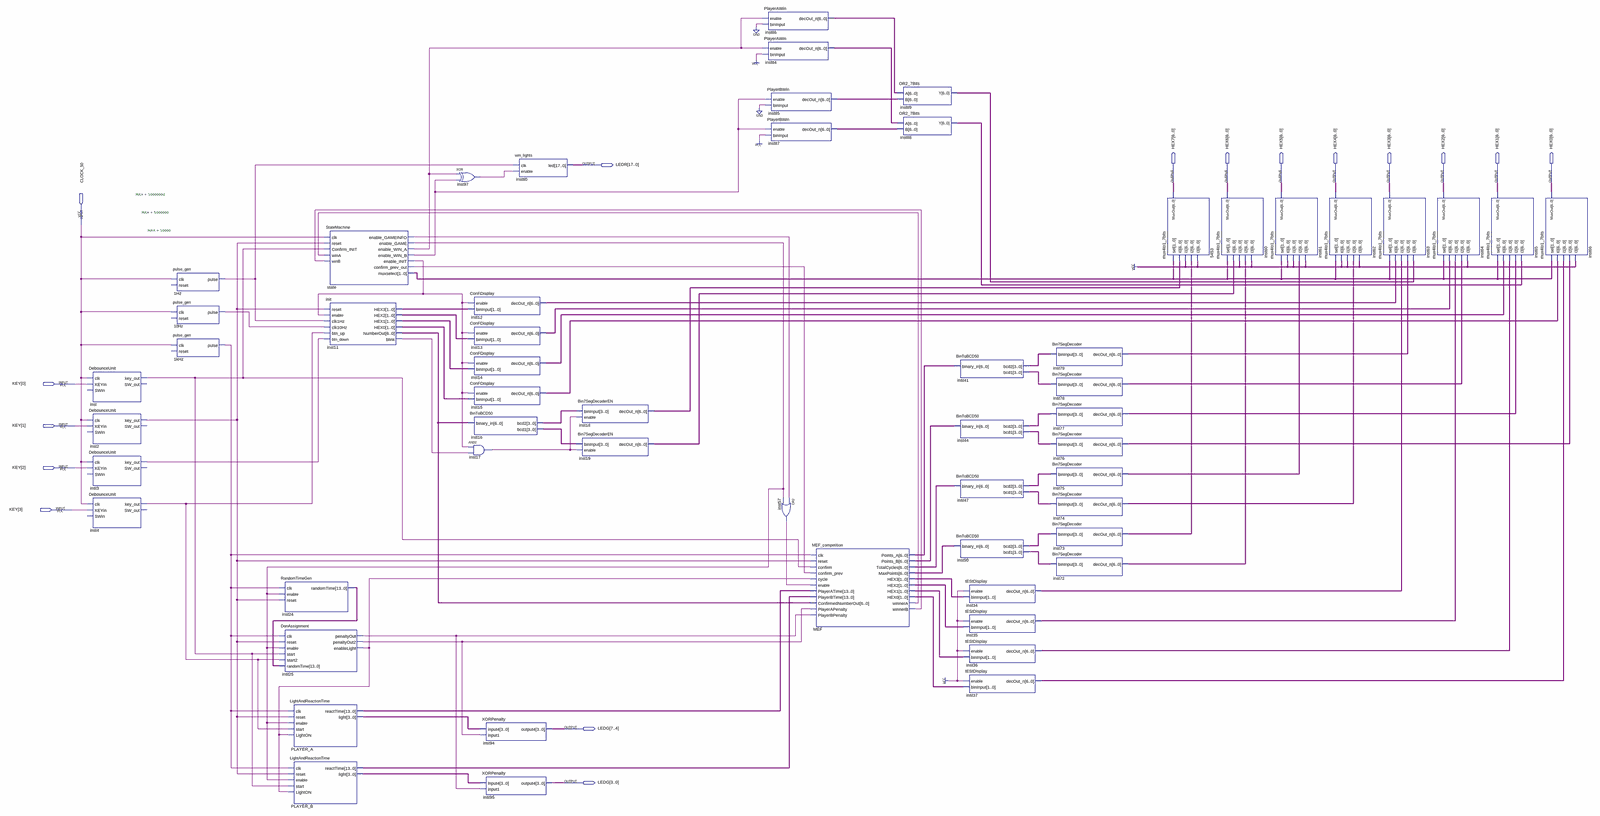
[diagram p0: schematic sheet, whole]
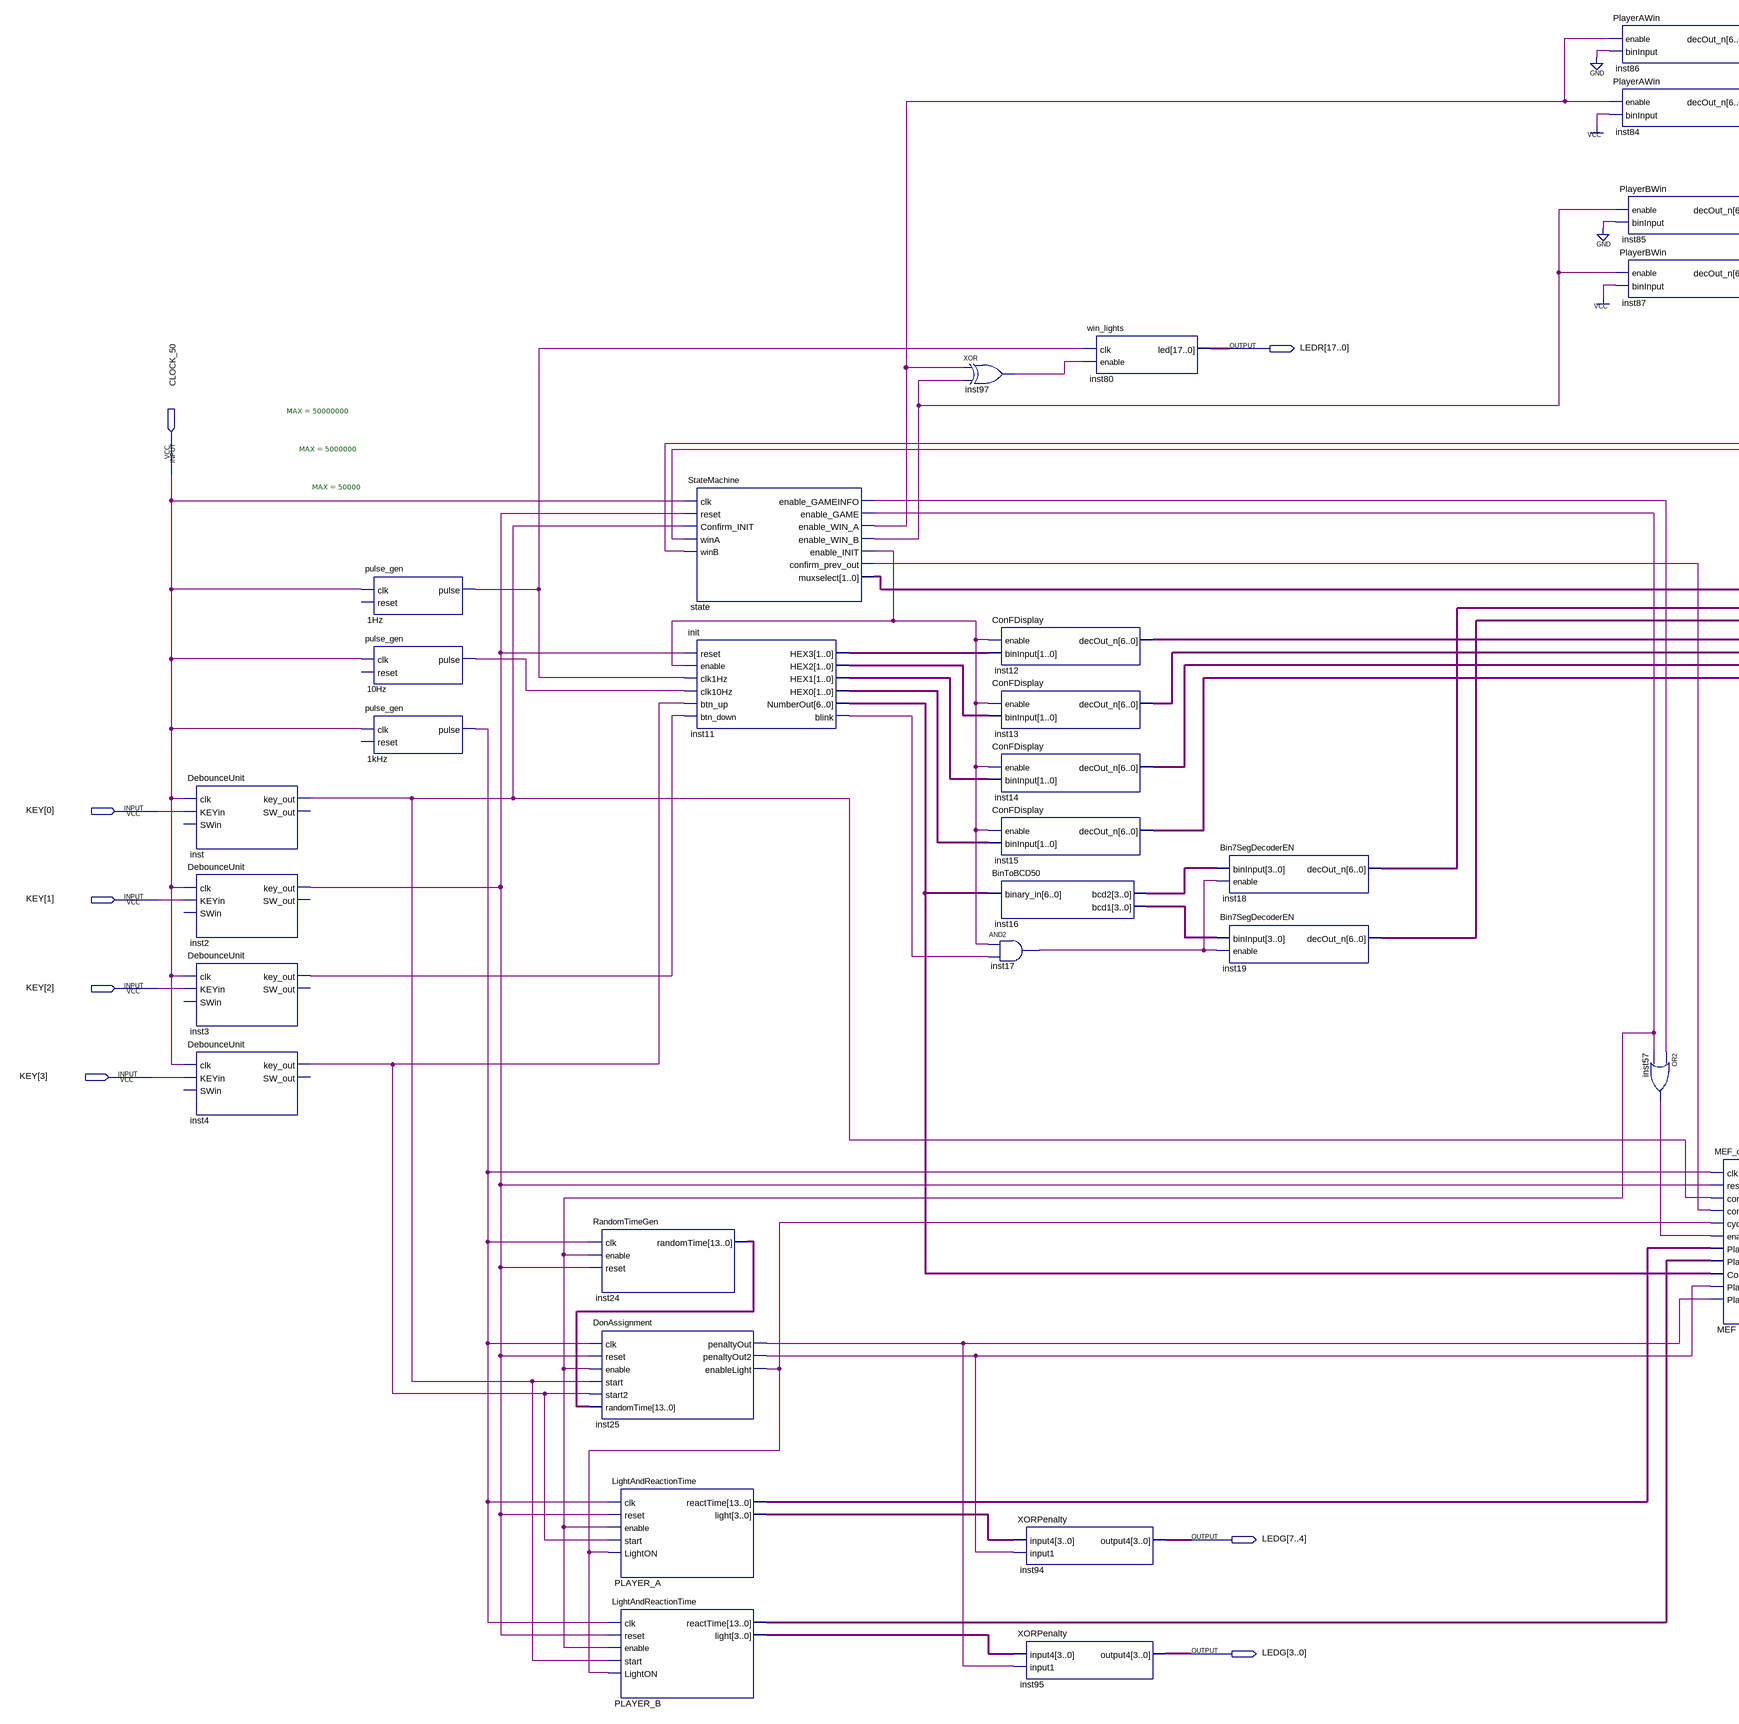
[diagram p1: schematic sheet, left part]
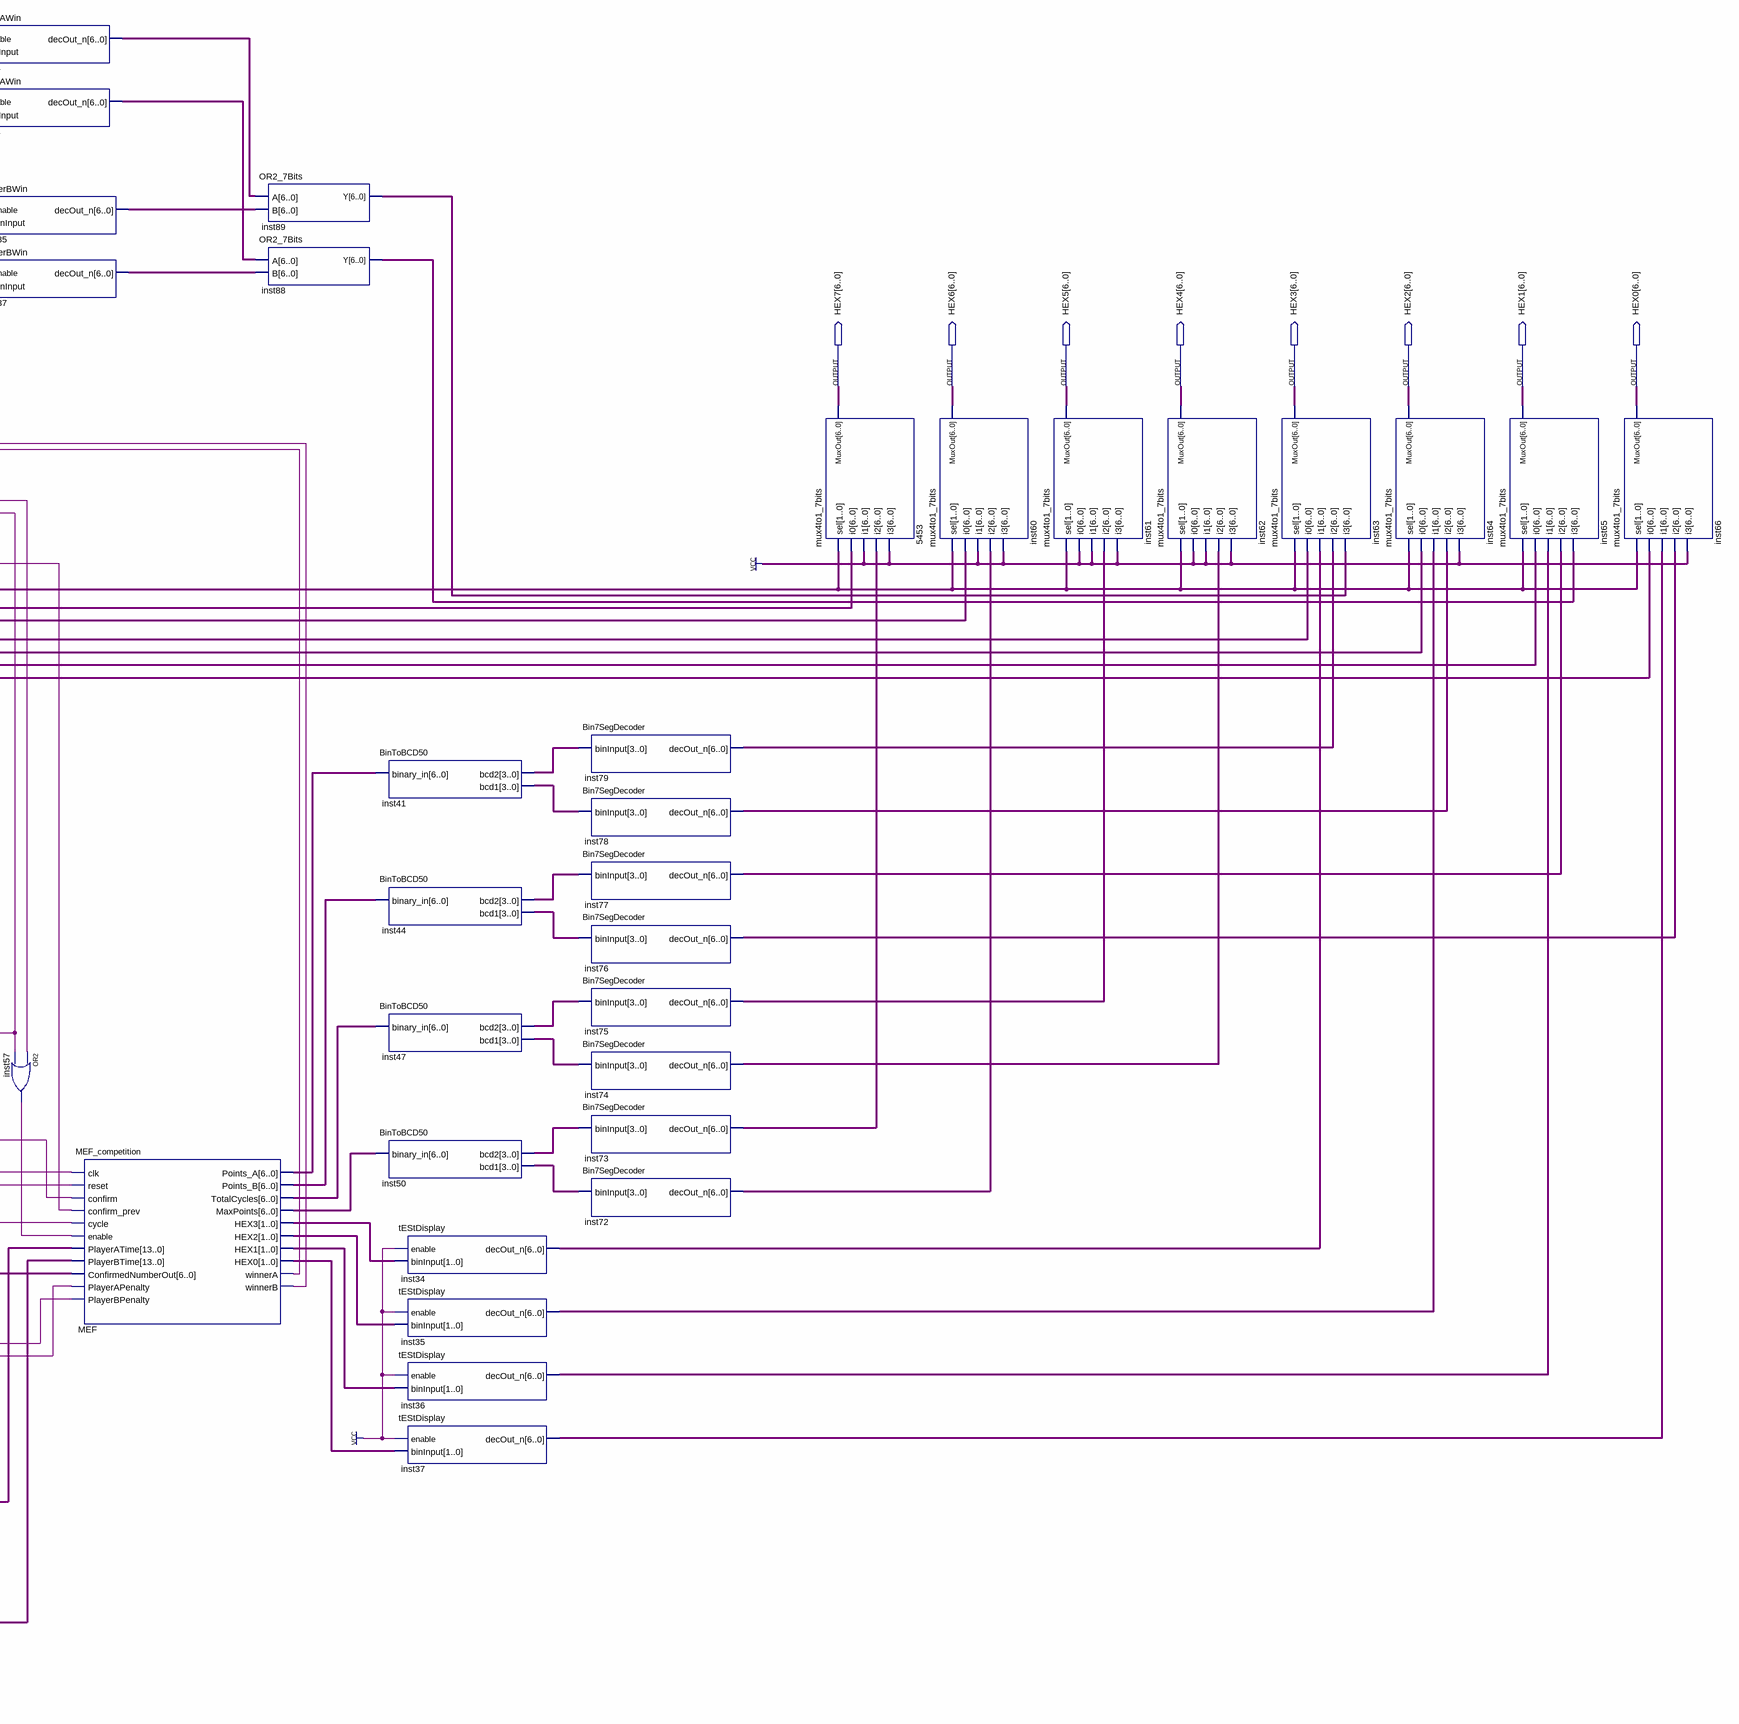
[diagram p2: schematic sheet, right part]
// Quartus schematic ReactionGame.bdf as structural Verilog: 57 symbols, 16 pins
module ReactionGame (
  input  CLOCK_50,
  input  [3:0] KEY,
  output [17:0] LEDR,
  output [6:0] HEX7,
  output [6:0] HEX6,
  output [6:0] HEX5,
  output [6:0] HEX4,
  output [6:0] HEX3,
  output [6:0] HEX2,
  output [6:0] HEX1,
  output [6:0] HEX0,
  output [7:0] LEDG
);

  wire inst2_key_out, inst3_key_out, inst4_key_out, inst11_blink, inst17_out, inst25_enablelight,
       inst25_penaltyout, inst25_penaltyout2, inst57_out, inst97_out, inst_key_out, MEF_winnera, MEF_winnerb,
       n1Hz_pulse, n1kHz_pulse, n10Hz_pulse, state_confirm_prev_out, state_enable_game,
       state_enable_gameinfo, state_enable_init, state_enable_win_a, state_enable_win_b;
  wire [1:0] inst11_hex0, inst11_hex1, inst11_hex2, inst11_hex3, MEF_hex0, MEF_hex1, MEF_hex2, MEF_hex3,
       state_muxselect;
  wire [3:0] inst16_bcd1, inst16_bcd2, inst41_bcd1, inst41_bcd2, inst44_bcd1, inst44_bcd2, inst47_bcd1,
       inst47_bcd2, inst50_bcd1, inst50_bcd2, PLAYER_A_light, PLAYER_B_light;
  wire [6:0] inst11_numberout, inst12_decout_n, inst13_decout_n, inst14_decout_n, inst15_decout_n,
       inst18_decout_n, inst19_decout_n, inst34_decout_n, inst35_decout_n, inst36_decout_n, inst37_decout_n,
       inst72_decout_n, inst73_decout_n, inst74_decout_n, inst75_decout_n, inst76_decout_n, inst77_decout_n,
       inst78_decout_n, inst79_decout_n, inst84_decout_n, inst85_decout_n, inst86_decout_n, inst87_decout_n,
       inst88_y, inst89_y, MEF_maxpoints, MEF_points_a, MEF_points_b, MEF_totalcycles;
  wire [13:0] inst24_randomtime, PLAYER_A_reacttime, PLAYER_B_reacttime;

  DebounceUnit inst (.clk(CLOCK_50), .KEYin(KEY[0]), .key_out(inst_key_out));  // open: SWin, SW_out
  DebounceUnit inst2 (.clk(CLOCK_50), .KEYin(KEY[1]), .key_out(inst2_key_out));  // open: SWin, SW_out
  DebounceUnit inst3 (.clk(CLOCK_50), .KEYin(KEY[2]), .key_out(inst3_key_out));  // open: SWin, SW_out
  DebounceUnit inst4 (.clk(CLOCK_50), .KEYin(KEY[3]), .key_out(inst4_key_out));  // open: SWin, SW_out
  pulse_gen #(.MAX(50000000)) u_1Hz (.clk(CLOCK_50), .pulse(n1Hz_pulse));  // open: reset
  pulse_gen #(.MAX(5000000)) u_10Hz (.clk(CLOCK_50), .pulse(n10Hz_pulse));  // open: reset
  pulse_gen #(.MAX(50000)) u_1kHz (.clk(CLOCK_50), .pulse(n1kHz_pulse));  // open: reset
  RandomTimeGen inst24 (
    .clk(n1kHz_pulse), .enable(state_enable_game), .reset(inst2_key_out), .randomTime(inst24_randomtime));
  DonAssignment inst25 (
    .clk(n1kHz_pulse), .reset(inst2_key_out), .enable(state_enable_game), .start(inst_key_out),
    .start2(inst4_key_out), .randomTime(inst24_randomtime), .penaltyOut(inst25_penaltyout),
    .penaltyOut2(inst25_penaltyout2), .enableLight(inst25_enablelight));
  LightAndReactionTime PLAYER_A (
    .clk(n1kHz_pulse), .reset(inst2_key_out), .enable(state_enable_game), .start(inst4_key_out),
    .LightON(inst25_enablelight), .reactTime(PLAYER_A_reacttime), .light(PLAYER_A_light));
  LightAndReactionTime PLAYER_B (
    .clk(n1kHz_pulse), .reset(inst2_key_out), .enable(state_enable_game), .start(inst_key_out),
    .LightON(inst25_enablelight), .reactTime(PLAYER_B_reacttime), .light(PLAYER_B_light));
  StateMachine state (
    .clk(CLOCK_50), .reset(inst2_key_out), .Confirm_INIT(inst_key_out), .winA(MEF_winnera),
    .winB(MEF_winnerb), .enable_GAMEINFO(state_enable_gameinfo), .enable_GAME(state_enable_game),
    .enable_WIN_A(state_enable_win_a), .enable_WIN_B(state_enable_win_b), .enable_INIT(state_enable_init),
    .confirm_prev_out(state_confirm_prev_out), .muxselect(state_muxselect));
  init inst11 (
    .reset(inst2_key_out), .enable(state_enable_init), .clk1Hz(n1Hz_pulse), .clk10Hz(n10Hz_pulse),
    .btn_up(inst4_key_out), .btn_down(inst3_key_out), .HEX3(inst11_hex3), .HEX2(inst11_hex2),
    .HEX1(inst11_hex1), .HEX0(inst11_hex0), .NumberOut(inst11_numberout), .blink(inst11_blink));
  xor inst97 (inst97_out, state_enable_win_a, state_enable_win_b);
  ConFDisplay inst12 (.enable(state_enable_init), .binInput(inst11_hex3), .decOut_n(inst12_decout_n));
  ConFDisplay inst13 (.enable(state_enable_init), .binInput(inst11_hex2), .decOut_n(inst13_decout_n));
  ConFDisplay inst14 (.enable(state_enable_init), .binInput(inst11_hex1), .decOut_n(inst14_decout_n));
  ConFDisplay inst15 (.enable(state_enable_init), .binInput(inst11_hex0), .decOut_n(inst15_decout_n));
  BinToBCD50 inst16 (.binary_in(inst11_numberout), .bcd2(inst16_bcd2), .bcd1(inst16_bcd1));
  and inst17 (inst17_out, state_enable_init, inst11_blink);
  XORPenalty inst94 (.input4(PLAYER_A_light), .input1(inst25_penaltyout2), .output4(LEDG[7:4]));
  XORPenalty inst95 (.input4(PLAYER_B_light), .input1(inst25_penaltyout), .output4(LEDG[3:0]));
  win_lights inst80 (.clk(n1Hz_pulse), .enable(inst97_out), .led(LEDR));
  Bin7SegDecoderEN inst18 (.binInput(inst16_bcd2), .enable(inst17_out), .decOut_n(inst18_decout_n));
  Bin7SegDecoderEN inst19 (.binInput(inst16_bcd1), .enable(inst17_out), .decOut_n(inst19_decout_n));
  PlayerAWin inst86 (.enable(state_enable_win_a), .binInput(1'b0), .decOut_n(inst86_decout_n));
  PlayerAWin inst84 (.enable(state_enable_win_a), .binInput(1'b1), .decOut_n(inst84_decout_n));
  PlayerBWin inst85 (.enable(state_enable_win_b), .binInput(1'b0), .decOut_n(inst85_decout_n));
  PlayerBWin inst87 (.enable(state_enable_win_b), .binInput(1'b1), .decOut_n(inst87_decout_n));
  or inst57 (inst57_out, state_enable_gameinfo, state_enable_game);
  MEF_competition MEF (
    .clk(n1kHz_pulse), .reset(inst2_key_out), .confirm(inst_key_out), .confirm_prev(state_confirm_prev_out),
    .cycle(inst25_enablelight), .enable(inst57_out), .PlayerATime(PLAYER_A_reacttime),
    .PlayerBTime(PLAYER_B_reacttime), .ConfirmedNumberOut(inst11_numberout),
    .PlayerAPenalty(inst25_penaltyout2), .PlayerBPenalty(inst25_penaltyout), .Points_A(MEF_points_a),
    .Points_B(MEF_points_b), .TotalCycles(MEF_totalcycles), .MaxPoints(MEF_maxpoints), .HEX3(MEF_hex3),
    .HEX2(MEF_hex2), .HEX1(MEF_hex1), .HEX0(MEF_hex0), .winnerA(MEF_winnera), .winnerB(MEF_winnerb));
  OR2_7Bits inst89 (.A(inst86_decout_n), .B(inst85_decout_n), .Y(inst89_y));
  OR2_7Bits inst88 (.A(inst84_decout_n), .B(inst87_decout_n), .Y(inst88_y));
  BinToBCD50 inst41 (.binary_in(MEF_points_a), .bcd2(inst41_bcd2), .bcd1(inst41_bcd1));
  BinToBCD50 inst44 (.binary_in(MEF_points_b), .bcd2(inst44_bcd2), .bcd1(inst44_bcd1));
  BinToBCD50 inst47 (.binary_in(MEF_totalcycles), .bcd2(inst47_bcd2), .bcd1(inst47_bcd1));
  BinToBCD50 inst50 (.binary_in(MEF_maxpoints), .bcd2(inst50_bcd2), .bcd1(inst50_bcd1));
  tEStDisplay inst34 (.enable(1'b1), .binInput(MEF_hex3), .decOut_n(inst34_decout_n));
  tEStDisplay inst35 (.enable(1'b1), .binInput(MEF_hex2), .decOut_n(inst35_decout_n));
  tEStDisplay inst36 (.enable(1'b1), .binInput(MEF_hex1), .decOut_n(inst36_decout_n));
  tEStDisplay inst37 (.enable(1'b1), .binInput(MEF_hex0), .decOut_n(inst37_decout_n));
  Bin7SegDecoder inst79 (.binInput(inst41_bcd2), .decOut_n(inst79_decout_n));
  Bin7SegDecoder inst78 (.binInput(inst41_bcd1), .decOut_n(inst78_decout_n));
  Bin7SegDecoder inst77 (.binInput(inst44_bcd2), .decOut_n(inst77_decout_n));
  Bin7SegDecoder inst76 (.binInput(inst44_bcd1), .decOut_n(inst76_decout_n));
  Bin7SegDecoder inst75 (.binInput(inst47_bcd2), .decOut_n(inst75_decout_n));
  Bin7SegDecoder inst74 (.binInput(inst47_bcd1), .decOut_n(inst74_decout_n));
  Bin7SegDecoder inst73 (.binInput(inst50_bcd2), .decOut_n(inst73_decout_n));
  Bin7SegDecoder inst72 (.binInput(inst50_bcd1), .decOut_n(inst72_decout_n));
  mux4to1_7bits u_5453 (
    .sel(state_muxselect), .i0(inst18_decout_n), .i1({7{1'b1}}), .i2(inst73_decout_n), .i3({7{1'b1}}),
    .MuxOut(HEX7));
  mux4to1_7bits inst60 (
    .sel(state_muxselect), .i0(inst19_decout_n), .i1({7{1'b1}}), .i2(inst72_decout_n), .i3({7{1'b1}}),
    .MuxOut(HEX6));
  mux4to1_7bits inst61 (
    .sel(state_muxselect), .i0({7{1'b1}}), .i1({7{1'b1}}), .i2(inst75_decout_n), .i3({7{1'b1}}), .MuxOut(HEX5));
  mux4to1_7bits inst62 (
    .sel(state_muxselect), .i0({7{1'b1}}), .i1({7{1'b1}}), .i2(inst74_decout_n), .i3({7{1'b1}}), .MuxOut(HEX4));
  mux4to1_7bits inst63 (
    .sel(state_muxselect), .i0(inst12_decout_n), .i1(inst34_decout_n), .i2(inst79_decout_n), .i3(inst89_y),
    .MuxOut(HEX3));
  mux4to1_7bits inst64 (
    .sel(state_muxselect), .i0(inst13_decout_n), .i1(inst35_decout_n), .i2(inst78_decout_n), .i3({7{1'b1}}),
    .MuxOut(HEX2));
  mux4to1_7bits inst65 (
    .sel(state_muxselect), .i0(inst14_decout_n), .i1(inst36_decout_n), .i2(inst77_decout_n), .i3(inst88_y),
    .MuxOut(HEX1));
  mux4to1_7bits inst66 (
    .sel(state_muxselect), .i0(inst15_decout_n), .i1(inst37_decout_n), .i2(inst76_decout_n), .i3({7{1'b1}}),
    .MuxOut(HEX0));
endmodule
